# Altium schematic sheet Sheet1.SchDoc
size A4; Author: Christian Kieser; Engineer: Christian Kieser
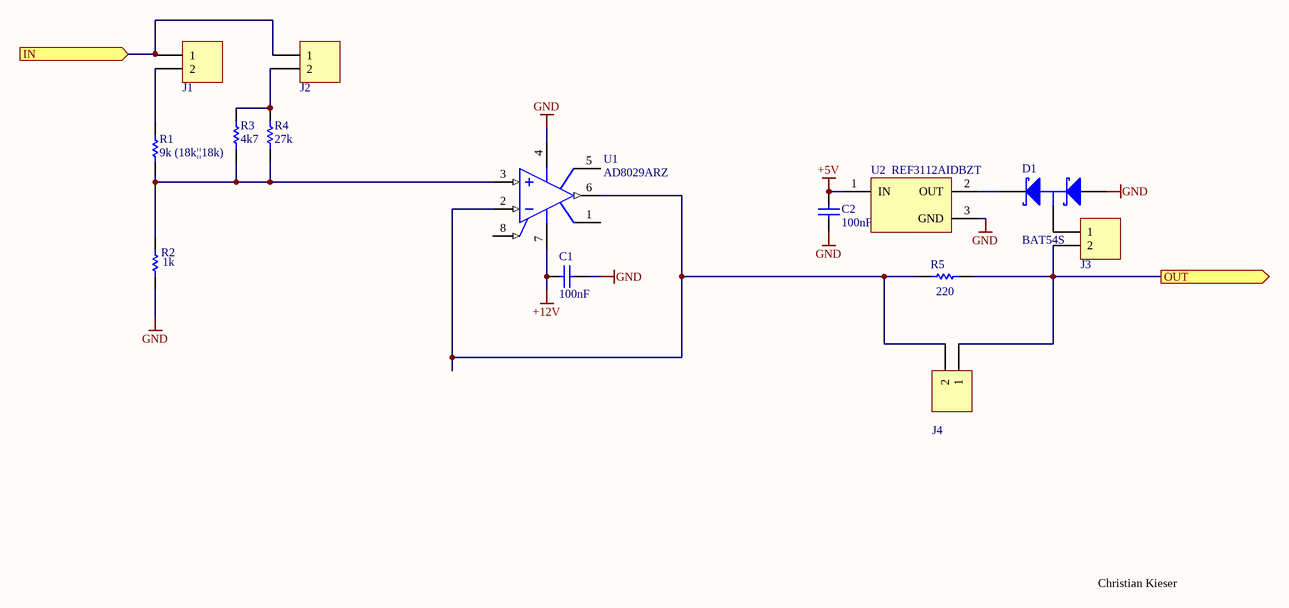
[diagram p0: Sheet1.SchDoc]

## Parts
C1  100nF  [CAPC2013X88X50ML20T25]
C2  100nF  [CAPC2013X88X50ML20T25]
D1  BAT54S  [FAIR-SOT23-3_V]
J1  61300211121  [61300211121]  (value not drawn)
J2  61300211121  [61300211121]  (value not drawn)
J3  61300211121  [61300211121]  (value not drawn)
J4  61300211121  [61300211121]  (value not drawn)
R1  9k (18k||18k)  [YAGO-RC0805_M]
R2  1k  [YAGO-RC0805_M]
R3  4k7  [YAGO-RC0805_M]
R4  27k  [YAGO-RC0805_M]
R5  220  [YAGO-RC0805_M]
U1  AD8029ARZ  [ADI-R-8_L]
U2  REF3112AIDBZT  [DBZ0003A_L]

## Ports
IN (in), OUT (out)

## Nets
+5V: C2.1 U2.1(IN)
+12V: C1.2 U1.7(+VS)
GND: C1.1 C2.2 D1.1(A) R2.1 U1.4(-VS) U2.3(GND)
IN: J1.1 J2.1 ; port IN
OUT: J3.2 J4.1 R5.1 ; port OUT
NetD1_2: D1.2(K) U2.2(OUT)
NetD1_3: D1.3(C) J3.1
NetJ1_2: J1.2 R1.2
NetJ2_2: J2.2 R3.2 R4.2
NetJ4_2: J4.2 R5.2 U1.2(-IN) U1.6(VOUT)
NetR1_1: R1.1 R2.2 R3.1 R4.1 U1.3(+IN)

Not connected (* = marked no-connect by the designer): U1 1(NC) 5(NC) 8(~{DISABLE})

## Notes on the sheet
- Christian Kieser
- Title
- Size:
- Modified:
- A4
- Project:
- Time:
- Sheet
- of
- Created:
- Author:
- Prj. #:
- Alfons Riedinger
- File:
- Revision:

## Library data of the parts
C1 C2 = CMP-001-0082-2: generic 0805 COG oder X7R Vielschichtkondensatoren max. +/-10%
D1 = CMP-00532-3: Schottky Barrier Diode, 30 V, 0.2 A, -55 to 150 degC, 3-Pin SOT23, RoHS, Tape and Reel; Manufacturer: DIODES INC.; ESR: 40 Ohm; Frequency: 16 MHz; Load Capacitance: 18 pF; Tolerance: 30ppm; Capacitance: 1.8E-11 f; Pins: 4; Length: 5 mm; ComponentLink3URL: http://www.fairchildsemi.com/dwg/MA/MA03D.pdf; RoHSCompliant: True; REACH SVHC: No SVHC; ComponentLink1URL: https://www.fairchildsemi.com/; Width: 3.2 mm; PackageDescription: 3-Pin Small Outline Transistor, Body 2.92 x 1.325 mm, Pitch 0.95 mm; ComponentLink2Description: Datasheet; Resistance: 40 Ohm; Max Operating Temperature: 70degC; ComponentLink2URL: https://www.fairchildsemi.com/datasheets/BA/BAT54S.pdf; Min Operating Temperature: -10degC; DatasheetVersion: Rev. 2.3, 04/2016; PackageReference: SOT23-3; Height: 0.9 mm; Frequency Tolerance: 30ppm; ComponentLink1Description: Manufacturer URL; Packaging: Tape and Reel; Mount: Surface Mount; Package Quantity: 1000; ComponentLink3Description: Package Specification; PartNumber: BAT54S
J1-J4 = CMP-001-0071-1: 2Pol; gerade; WR-PHD 2.54 mm THT Pin Header; Brand: Wurth Electronics; Current Rating: 3 A; Insulation Resistance: 1 GOhms; Latching Type: Unlatched; Mating Post Length: 6 mm; Mounting Angle: Straight; Number of Positions: 2 Position; Pitch: 2.54 mm; Voltage Rating: 250 V; Accessory Type: -; Application: Wire to Board; ComponentLink1Description: 6130xx11121-538006.pdf; ComponentLink1URL: http://www.mouser.com/ds/2/445/6130xx11121-538006.pdf; Contact Gender: Pin (Male); Contact Material: Copper Alloy; Contact Plating: Gold; Contact Type: -; Flammability Rating: UL 94 V-0; Housing Gender: -; Housing Material: Polybutylene Terephthalate (PBT); Manufacturer: Wurth Electronics; Manufacturer Part Number: 61300211121; Minimum Order Quantity: 1; Mounting Style: Straight Pin; Number of Rows: 1 Row; Packaging: Bulk; Product: Headers; Reeling: False; RoHS - Mouser: Y; Row Spacing: -; Series: WR-PHD; Standard Pack Qty: 1000; Supplier: Mouser; Supplier Part Number: 710-61300211121; Termination Post Length: 3 mm; Termination Style: Through Hole; Type: Pin Strip; PartNumber: 61300211121
R1-R5 = CMP-001-0027-2: 0805 Yageo Standard BlackBox Resistors; Power (Watts): 0.125W, 1/8W; Temperature Coefficient: ±200ppm/°C; Tolerance: ±1%; ComponentLink1Description: PYu-RC_Group_51_RoHS_L_7.pdf; Part Status: Active; Size / Dimension: 0.079" L x 0.049" W (2.00mm x 1.25mm); Supplier Device Package: 0805; ComponentLink1URL: http://www.yageo.com/documents/recent/PYu-RC_Group_51_RoHS_L_7.pdf; Composition: Thick Film; Failure Rate: -; Features: Moisture Resistant; Height - Seated (Max): 0.024" (0.60mm); Manufacturer: Yageo; Operating Temperature: -55°C ~ 155°C; Package / Case: 0805 (2012 Metric); Packaging: Digi-Reel®
U1 = CMP-00480-1: Single Channel RRIO Operational Amplifier, 125 MHz BW, 62 V/us SR, Industrial, 8-pin SOIC (R-8), Tube; Manufacturer: Analog Devices; Generic Part Number: AD8029; Slew Rate: 62V/us; V Span Min: 2.7V; Input Bias Current: 700nA; Amplifiers Per Package: 1; Iq/Amp: 1.5mA; V Span Max: 12V; Input Offset Voltage: 1.6mV; Small Signal Bandwidth: 125MHz; PackageVersion: 060506-A; ComponentLink3URL: http://www.analog.com/static/imported-files/packages/PKG_PDF/SOIC_Narrow%20(R)/R_8.pdf; ComponentLink1Description: Manufacturer URL; ComponentLink1URL: http://www.analog.com/en/index.html; Code_JEDEC: MS-012-AA; ComponentLink2URL: http://www.analog.com/static/imported-files/data_sheets/AD8029_8030_8040.pdf; ComponentLink3Description: Package Specification; PackageDescription: 8-Pin Standard Small Outline Package, Body 3.9 x 4.9 mm, Pitch 1.27 mm; PartNumber: AD8029ARZ; Mounting Technology: Surface Mount; PackageReference: R-8; DatasheetVersion: Rev. B; ComponentLink2Description: Datasheet
U2 = CMP-00534-1: 20 ppm / degC Max, 100 uA Series Voltage Reference, 3-pin SOT-23 (DBZ), Green (RoHS & no Sb/Br); Manufacturer: Texas Instruments; Temp Coeff(Max)(ppm/ degree C): 20; VO(V): 1.25; VI(Min)(V): 1.8; VI(Max)(V): 5.5; Rating: Catalog; Initial Accuracy @ 25/deg C(%): 0.2; Iq(Max)(uA): 100; Temp Coeff(Typ)(ppm/ degree C): 10; PackageDescription: 3-Pin Plastic Small Outline, Body 2.92 x 1.3 mm, Pitch 0.95 mm; SubFamily: Series Voltage Reference; Code_JEDEC: TO-236; PackageReference: DBZ0003A; PackageVersion: 4203227/B; ComponentLink2Description: Datasheet; Mounting Technology: Surface Mount; ComponentLink3URL: http://www.ti.com/litv/pdf/mpds108a; ComponentLink1Description: Manufacturer URL; DatasheetVersion: SBVS046C; PartNumber: REF3112AIDBZT; ComponentLink3Description: Package Specification; ComponentLink2URL: http://www.ti.com/general/docs/lit/getliterature.tsp?genericPartNumber=REF3112&fileType=pdf; ComponentLink1URL: http://www.ti.com/; Eco-Plan: Green (RoHS & no Sb/Br)